# Altium schematic sheet TP_Charger.SchDoc
size A4
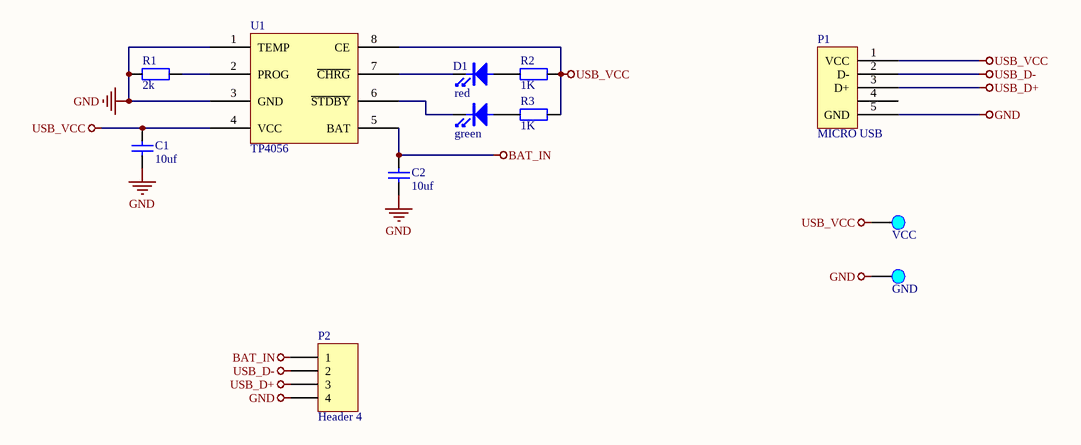
[diagram p0: TP_Charger.SchDoc]

## Parts
C1  10uf  [电容_C0603]
C2  10uf  [电容_C0603]
D1  red  [LED_0603]
D2  green  [LED_0603]
P1  MICRO USB  [接插件_MICRO 牛角插座 USB 卷边]
P2  Header 4  [HDR1X4]
Pad1  VCC  [Pad_B]
Pad2  GND  [Pad_B]
R1  2k  [电阻_R0603]
R2  1K  [电阻_R0603]
R3  R: 1K  [电阻_R0603]  (hidden comment: 2k)
U1  TP4056  [充电芯片_HSOP8]

## Nets
BAT_IN: C2.2 P2.1 U1.5(BAT)
GND: C1.1 C2.1 P1.0 P1.5(GND) P2.4 Pad2.1 R1.1 U1.0(GND) U1.1(TEMP) U1.3(GND)
USB_D+: P1.3(D+) P2.3
USB_D-: P1.2(D-) P2.2
USB_VCC: C1.2 P1.1(VCC) Pad1.1 R2.2 R3.2 U1.4(VCC) U1.8(CE)
NetD1_A: D1.A R2.1
NetD1_K: D1.K U1.7(~{CHRG})
NetD2_A: D2.A R3.1
NetD2_K: D2.K U1.6(~{STDBY})
NetR1_2: R1.2 U1.2(PROG)

Not connected (* = marked no-connect by the designer): P1 4

## Library data of the parts
C1 C2 = cap: U: 50V; 参数: Cap,0805,X7R,104K,50V,125C,±10%; C: 10uf
D1 D2 = LED: 参数: LED,0603,Red
P1 = MICRO USB 5PIN: _Comma: ,; _Name: Port; _Specification: Port,MICRO USB,5PIN; _Value: 5PIN; _Model: MICRO USB
P2 = Header 4: Header, 4-Pin; LatestRevisionDate: 17-Jul-2002; LatestRevisionNote: Re-released for DXP Platform.; Publisher: Altium Limited
Pad1 = Pad: _Funcyusa: Test; _Specification: Pad,Test,VCC; _Comma: ,; _Name: Pad; _Remarks: VCC
Pad2 = Pad: _Funcyusa: Test; _Specification: Pad,Test,GND; _Comma: ,; _Name: Pad; _Remarks: GND
R1-R3 = Res: P: 1/8W; 参数: Res,0805,0R,±1%,1/8W,100ppm,155C
  R1: R: 2k
  R2: R: 1K
U1 = TP4056: _Footprint: HSOP8; _Comma: ,; _Name: Charge Control; _Specification: Charge Control,TP4056,HSOP8; _Model: TP4056